# EAGLE design nixie_2020_mainboard_v3_6digit (EAGLE 9.6.2)
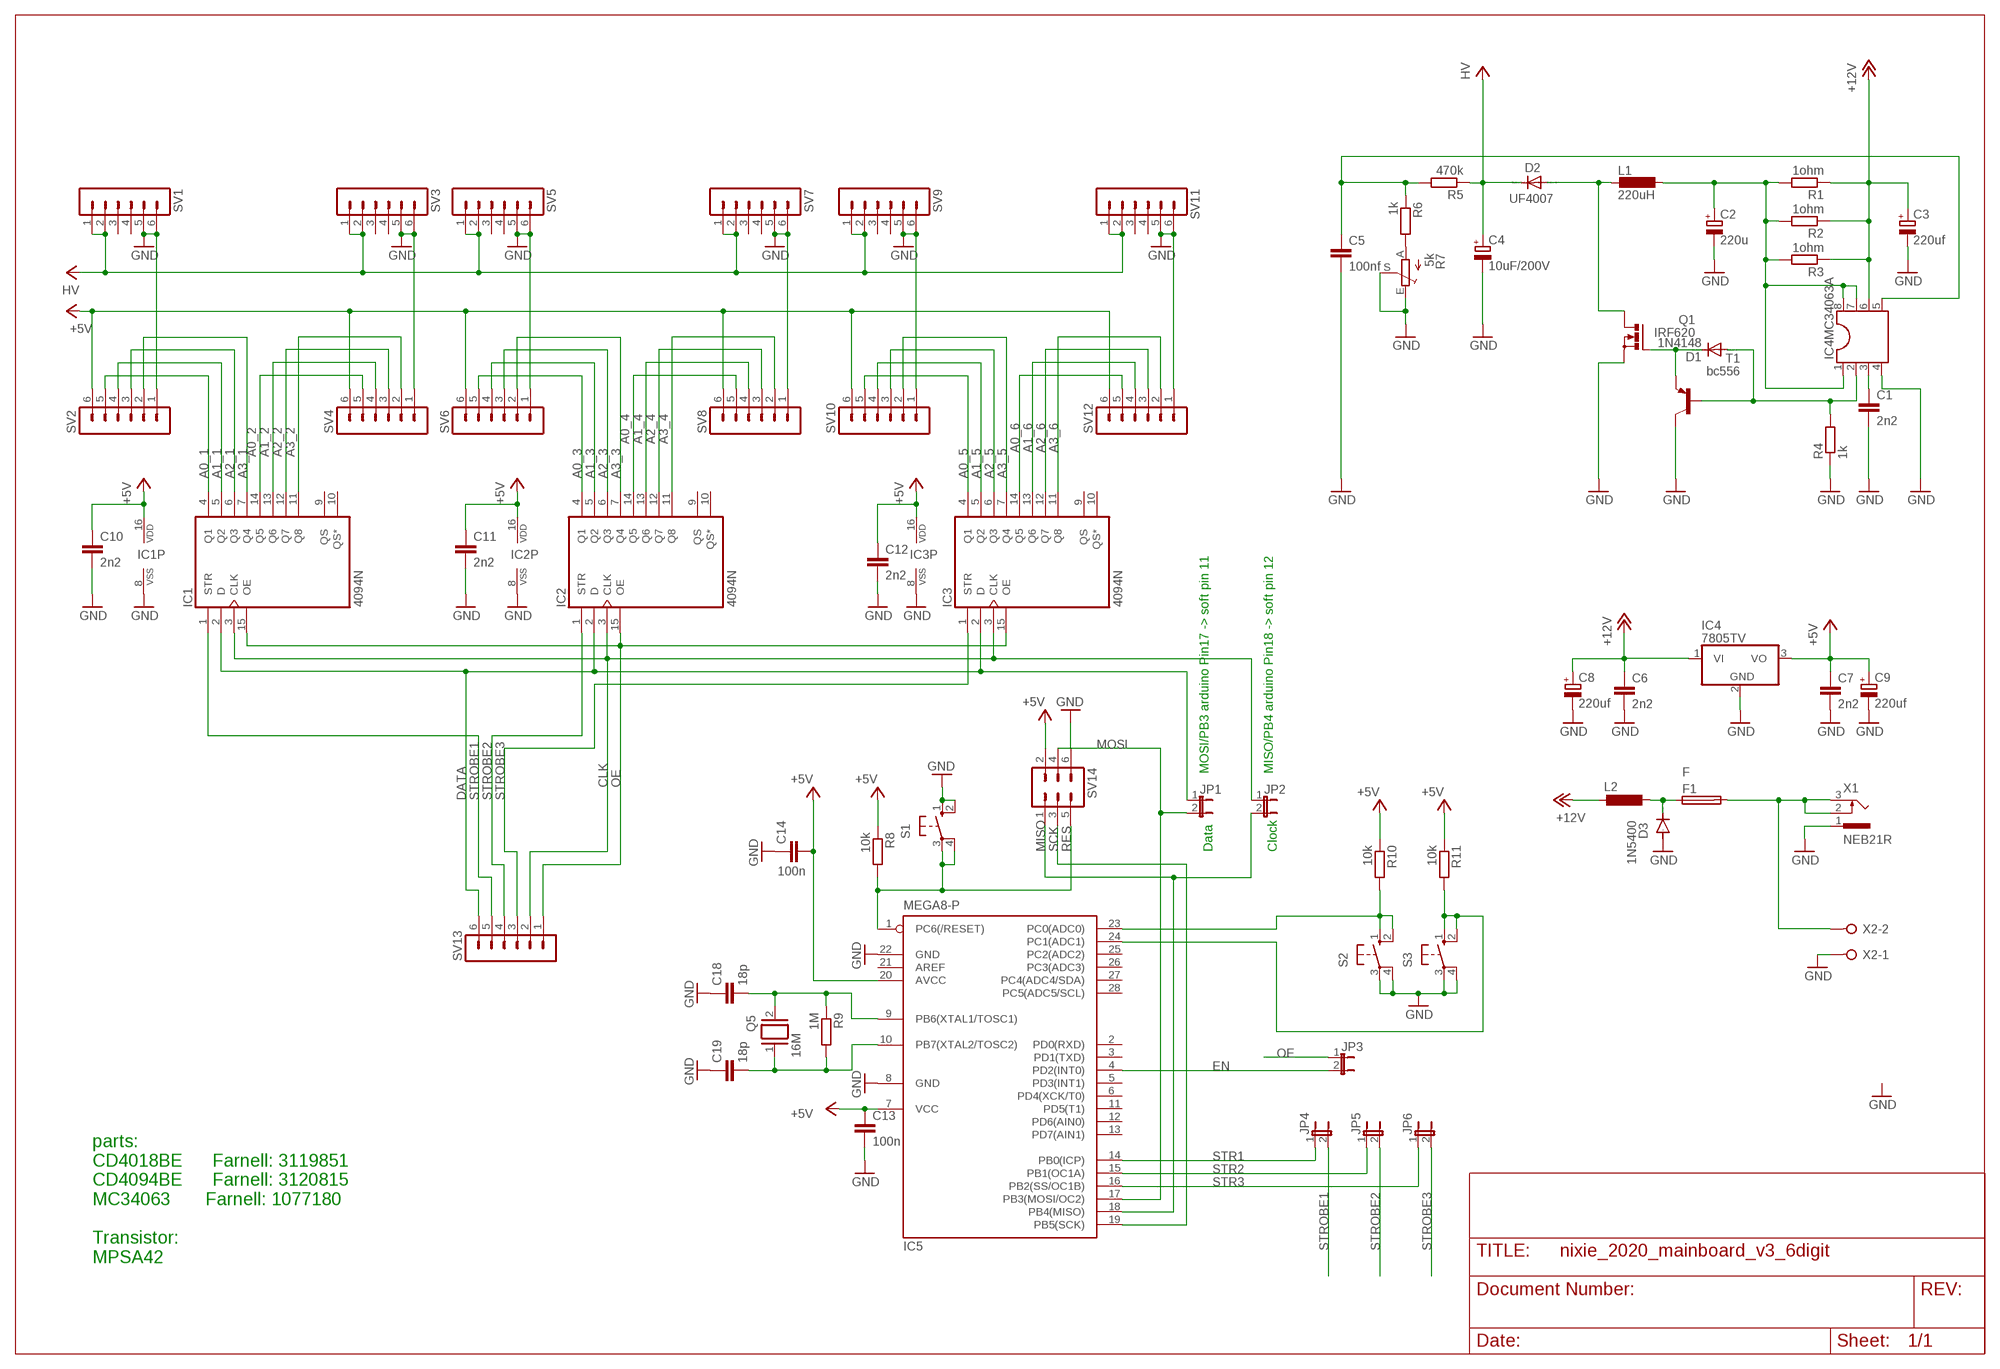
[diagram p0: schematic, sheet 1]

## Parts
C1  2n2  C-EU050-030X075  [C050-030X075]
C2  220u  CPOL-EUE5-10.5  [E5-10,5]
C3  220uf  CPOL-EUE5-10.5  [E5-10,5]
C4  10uF/200V  CPOL-EUE5-10.5  [E5-10,5]
C5  100nf  C-EU075-042X103  [C075-042X103]
C6  2n2  C-EU050-030X075  [C050-030X075]
C7  2n2  C-EU050-030X075  [C050-030X075]
C8  220uf  CPOL-EUE5-10.5  [E5-10,5]
C9  220uf  CPOL-EUE5-10.5  [E5-10,5]
C10  2n2  C-EU050-030X075  [C050-030X075]
C11  2n2  C-EU050-030X075  [C050-030X075]
C12  2n2  C-EU050-030X075  [C050-030X075]
C13  100n  C-EU050-025X075  [C050-025X075]
C14  100n  C-EU050-025X075  [C050-025X075]
C18  18p  C-EU050-025X075  [C050-025X075]
C19  18p  C-EU050-025X075  [C050-025X075]
D1  1N4148  1N4148DO35-10  [DO35-10]
D2  UF4007  BAV21  [DO35-10]
D3  1N5400  [DO201-15]
F1  F  FUSESHK20L  [SHK20L]
IC1  4094N  [DIL16]
IC2  4094N  [DIL16]
IC3  4094N  [DIL16]
IC4  7805TV  [TO220V]
IC4MC34063A  DIL8S  [SOCKET-08]
IC5  MEGA8-P  [DIL28-3]
JP1  JP1E  [JP1]
JP2  JP1E  [JP1]
JP3  JP1E  [JP1]
JP4  JP1E  [JP1]
JP5  JP1E  [JP1]
JP6  JP1E  [JP1]
L1  220uH  L-EULAN02KR  [LAN02KR]
L2  L-EU0207/10  [0207/10]
Q1  IRF620  IRF512  [TO220BV]
Q5  16M  XTAL/S  [QS]
R1  1ohm  R-EU_0207/12  [0207/12]
R2  1ohm  R-EU_0207/12  [0207/12]
R3  1ohm  R-EU_0207/12  [0207/12]
R4  1k  R-EU_0207/12  [0207/12]
R5  470k  R-EU_0207/12  [0207/12]
R6  1k  R-EU_0207/12  [0207/12]
R7  5k  TRIM_EU-RJ9W  [RJ9W]
R8  10k  R-EU_0207/12  [0207/12]
R9  1M  R-EU_0207/12  [0207/12]
R10  10k  R-EU_0207/12  [0207/12]
R11  10k  R-EU_0207/12  [0207/12]
S1  10-XX  [B3F-10XX]
S2  10-XX  [B3F-10XX]
S3  10-XX  [B3F-10XX]
SV1  MA06-1  [MA06-1]
SV2  MA06-1  [MA06-1]
SV3  MA06-1  [MA06-1]
SV4  MA06-1  [MA06-1]
SV5  MA06-1  [MA06-1]
SV6  MA06-1  [MA06-1]
SV7  MA06-1  [MA06-1]
SV8  MA06-1  [MA06-1]
SV9  MA06-1  [MA06-1]
SV10  MA06-1  [MA06-1]
SV11  MA06-1  [MA06-1]
SV12  MA06-1  [MA06-1]
SV13  MA06-1  [MA06-1]
SV14  MA03-2  [MA03-2]
T1  bc556  BC556A-PNP-TO92-EBC  [TO92-EBC]
X1  NEB21R  [NEB21R]
X2  W237-02P  [W237-132]

## Nets
+5V: C7.1 C9.+ C10.1 C11.1 C12.1 C13.1 C14.2 IC1.16(VDD) IC2.16(VDD) IC3.16(VDD) IC4.3(VO) IC5.7(VCC) IC5.20(AVCC) R8.1 R10.1 R11.1 SV2.6 SV4.6 SV6.6 SV8.6 SV10.6 SV12.6 SV14.2
+12V: C3.+ C6.1 C8.+ IC4.1(VI) IC4MC34063A.6 L2.1 R1.1 R2.1 R3.1
A0_1: IC1.4(Q1) SV2.5
A0_2: IC1.14(Q5) SV4.5
A0_3: IC2.4(Q1) SV6.5
A0_4: IC2.14(Q5) SV8.5
A0_5: IC3.4(Q1) SV10.5
A0_6: IC3.14(Q5) SV12.5
A1_1: IC1.5(Q2) SV2.4
A1_2: IC1.13(Q6) SV4.4
A1_3: IC2.5(Q2) SV6.4
A1_4: IC2.13(Q6) SV8.4
A1_5: IC3.5(Q2) SV10.4
A1_6: IC3.13(Q6) SV12.4
A2_1: IC1.6(Q3) SV2.3
A2_2: IC1.12(Q7) SV4.3
A2_3: IC2.6(Q3) SV6.3
A2_4: IC2.12(Q7) SV8.3
A2_5: IC3.6(Q3) SV10.3
A2_6: IC3.12(Q7) SV12.3
A3_1: IC1.7(Q4) SV2.2
A3_2: IC1.11(Q8) SV4.2
A3_3: IC2.7(Q4) SV6.2
A3_4: IC2.11(Q8) SV8.2
A3_5: IC3.7(Q4) SV10.2
A3_6: IC3.11(Q8) SV12.2
CLK: IC1.3(CLK) IC2.3(CLK) IC3.3(CLK) JP2.1 SV13.2
DATA: IC1.2(D) IC2.2(D) IC3.2(D) JP1.1 SV13.6
EN: IC5.4(PD2(INT0)) JP3.2
GND: C1.2 C2.- C3.- C4.- C5.2 C6.2 C7.2 C8.- C9.- C10.2 C11.2 C12.2 C13.2 C14.1 C18.1 C19.1 D3.A IC1.8(VSS) IC2.8(VSS) IC3.8(VSS) IC4.2(GND) IC4MC34063A.4 IC5.8(GND) IC5.22(GND) Q1.S R4.1 R7.E R7.S S1.1(S) S1.2(S1) S2.3(P) S2.4(P1) S3.3(P) S3.4(P1) SV1.5 SV1.6 SV2.1 SV3.5 SV3.6 SV4.1 SV5.5 SV5.6 SV6.1 SV7.5 SV7.6 SV8.1 SV9.5 SV9.6 SV10.1 SV11.5 SV11.6 SV12.1 SV14.6 T1.C X1.1 X2.1
MISO: IC5.18(PB4(MISO)) JP2.2 SV14.1
MOSI: IC5.17(PB3(MOSI/OC2)) JP1.2 SV14.4
N$1: F1.2A X1.2 X1.3 X2.2
N$2: D3.C F1.1A L2.2
N$4: IC5.23(PC0(ADC0)) R10.2 S2.1(S) S2.2(S1)
N$6: IC5.24(PC1(ADC1)) R11.2 S3.1(S) S3.2(S1)
N$35: C18.2 IC5.9(PB6(XTAL1/TOSC1)) Q5.2 R9.1
N$36: C19.2 IC5.10(PB7(XTAL2/TOSC2)) Q5.1 R9.2
N$88: C1.1 IC4MC34063A.3
N$89: D1.A IC4MC34063A.2 R4.2 T1.B
N$90: D1.C Q1.G T1.E
N$91: D2.A L1.2 Q1.D
N$92: C2.+ IC4MC34063A.1 IC4MC34063A.7 IC4MC34063A.8 L1.1 R1.2 R2.2 R3.2
N$93: C5.1 IC4MC34063A.5 R5.2 R6.1
N$94: R6.2 R7.A
OE: IC1.15(OE) IC2.15(OE) IC3.15(OE) JP3.1 SV13.1
RES: IC5.1(PC6(/RESET)) R8.2 S1.3(P) S1.4(P1) SV14.5
SCK: IC5.19(PB5(SCK)) SV14.3
STR1: IC5.14(PB0(ICP)) JP4.1
STR2: IC5.15(PB1(OC1A)) JP5.1
STR3: IC5.16(PB2(SS/OC1B)) JP6.1
STROBE1: IC1.1(STR) JP4.2 SV13.5
STROBE2: IC2.1(STR) JP5.2 SV13.4
STROBE3: IC3.1(STR) JP6.2 SV13.3
VCC: C4.+ D2.C R5.1 SV1.1 SV1.2 SV3.1 SV3.2 SV5.1 SV5.2 SV7.1 SV7.2 SV9.1 SV9.2 SV11.1 SV11.2 ; supply symbol labelled HV
Unconnected: IC1.9(QS) IC1.10(QS*) IC2.9(QS) IC2.10(QS*) IC3.9(QS) IC3.10(QS*) IC5.2(PD0(RXD)) IC5.3(PD1(TXD)) IC5.5(PD3(INT1)) IC5.6(PD4(XCK/T0)) IC5.11(PD5(T1)) IC5.12(PD6(AIN0)) IC5.13(PD7(AIN1)) IC5.21(AREF) IC5.25(PC2(ADC2)) IC5.26(PC3(ADC3)) IC5.27(PC4(ADC4/SDA)) IC5.28(PC5(ADC5/SCL)) SV1.3 SV1.4 SV3.3 SV3.4 SV5.3 SV5.4 SV7.3 SV7.4 SV9.3 SV9.4 SV11.3 SV11.4

## Notes on the sheet
- MOSI/PB3 arduino Pin17 -> soft pin 11 | MISO/PB4 arduino Pin18 -> soft pin 12
- Data | Clock
- parts:
  CD4018BE      Farnell: 3119851
  CD4094BE      Farnell: 3120815
  MC34063       Farnell: 1077180
  
  Transistor:
  MPSA42

## Library data of the parts
C1 C5-C7 C10-C12 = rcl:C-EU: CAPACITOR, European symbol
C2-C4 C8 C9 = rcl:CPOL-EU: POLARIZED CAPACITOR, European symbol
C13 C14 C18 C19 = resistor:C-EU: CAPACITOR, European symbol
D1 = diode:1N4148: DIODE high speed (Philips)
D2 = diode:BAV21: DIODE high-voltage general purpose diode
D3 = diode:1N5400: DIODE standard rectifier, 3 A, 50 V (Motorola)
F1 = fuse:FUSE: Fuse; OC_FARNELL: unknown; OC_NEWARK: unknown
IC1-IC3 = 40xx:4094: 8-stage SHIFT/STORE REGISTER, tri-state
IC4 = linear:78*: Positive VOLTAGE REGULATOR Source: http://cache.national.com/ds/LM/LM78L05.pdf http://www.fairchildsemi.com/ds/LM/LM7805.pdf
IC4MC34063A = ic-package:DIL8: Dual In Line / Socket
IC5 = atmel:MEGA8-P: MICROCONTROLLER 8 Kbytes FLASH, 1 kbytes SRAM, 512 bytes EEPROM, USART, 4-channel 10 bit ADC, 2-channel 8 bit ADC Pin compatible with Atmega48, ATMega88, ATMega168 Source: avr.lbr; OC_FARNELL: unknown; OC_NEWARK: unknown
JP1-JP6 = jumper:JP1E: JUMPER
L1 = rcl:L-EU: INDUCTOR, European symbol
L2 = rcl:L-EU: INDUCTOR, European symbol; SPICEPREFIX: L
Q1 = transistor-power:IRF512: N-CHANNEL MOS FET
Q5 = special:XTAL/S: CRYSTAL
R1-R6 R8-R11 = rcl:R-EU_: RESISTOR, European symbol
R7 = pot:TRIM_EU-: POTENTIOMETER
S1-S3 = switch-omron:10-XX: OMRON SWITCH; MPN: B3F-1000; OC_FARNELL: 176432; OC_NEWARK: 36M3542
SV1-SV13 = con-lstb:MA06-1: PIN HEADER; OC_FARNELL: unknown; OC_NEWARK: unknown
SV14 = con-lstb:MA03-2: PIN HEADER; OC_FARNELL: unknown; OC_NEWARK: unknown
T1 = transistor:*-PNP-: PNP Transistror
X1 = con-lumberg:NEB21R: Netzgeräte-Einbaukupplung abgewinkelte Ausführung mit Öffner Source: http://www.lumberg.com/Produkte/PDFs/NEB21R.pdf; MPN: NEB 21 R; OC_FARNELL: 1217037; OC_NEWARK: 97K6458
X2 = con-wago-508:W237-02P: WAGO SREW CLAMP; OC_FARNELL: unknown; OC_NEWARK: unknown

## Board
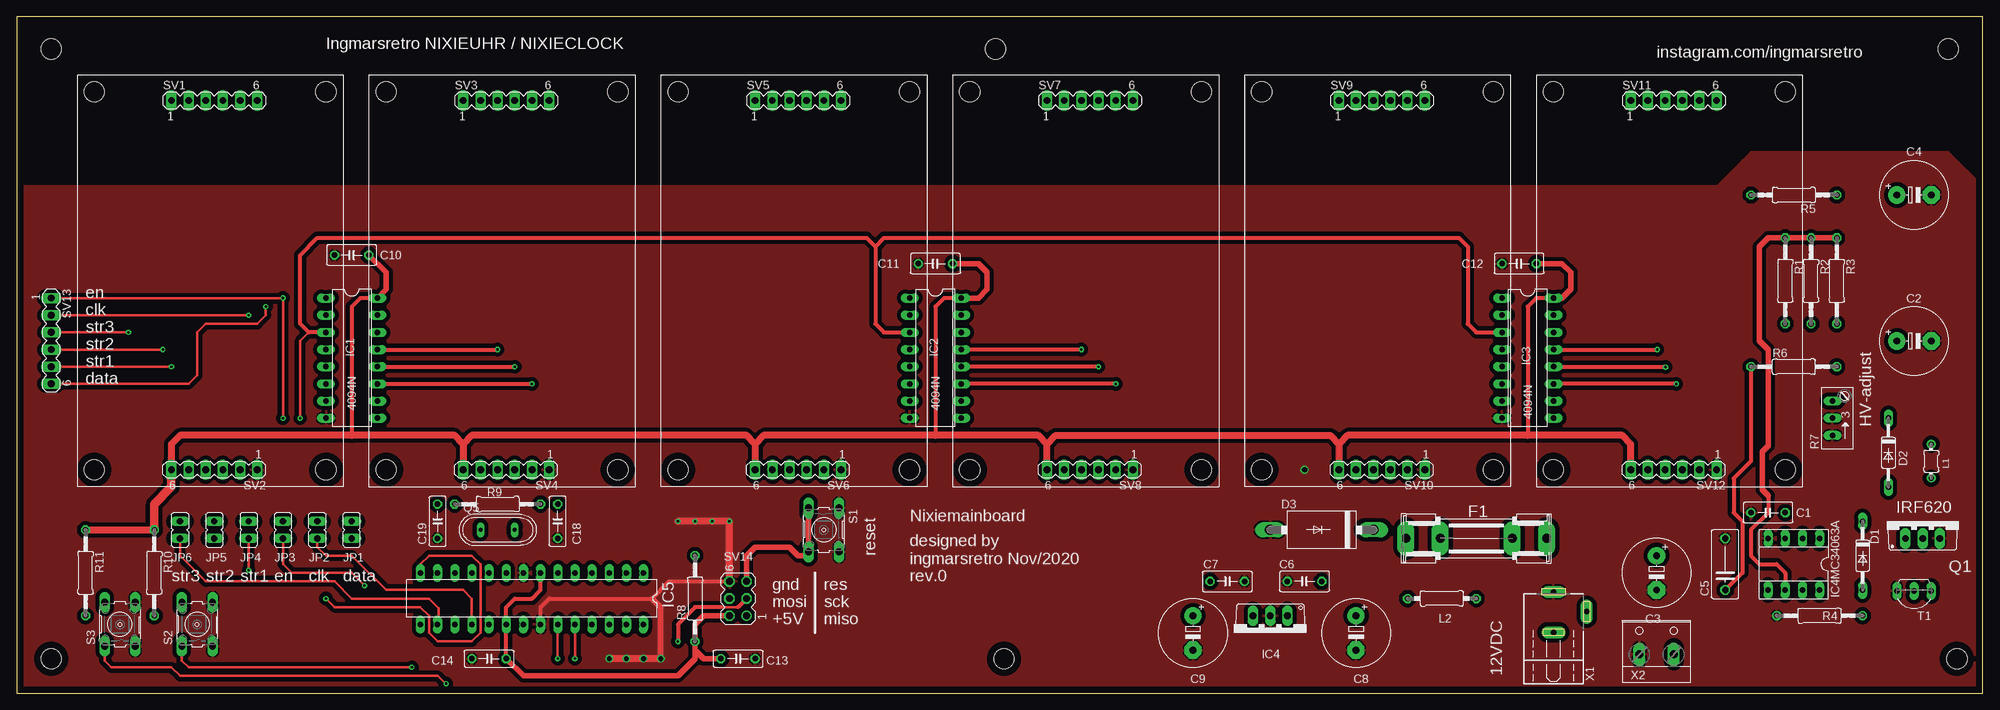
[diagram p1: board, top side]
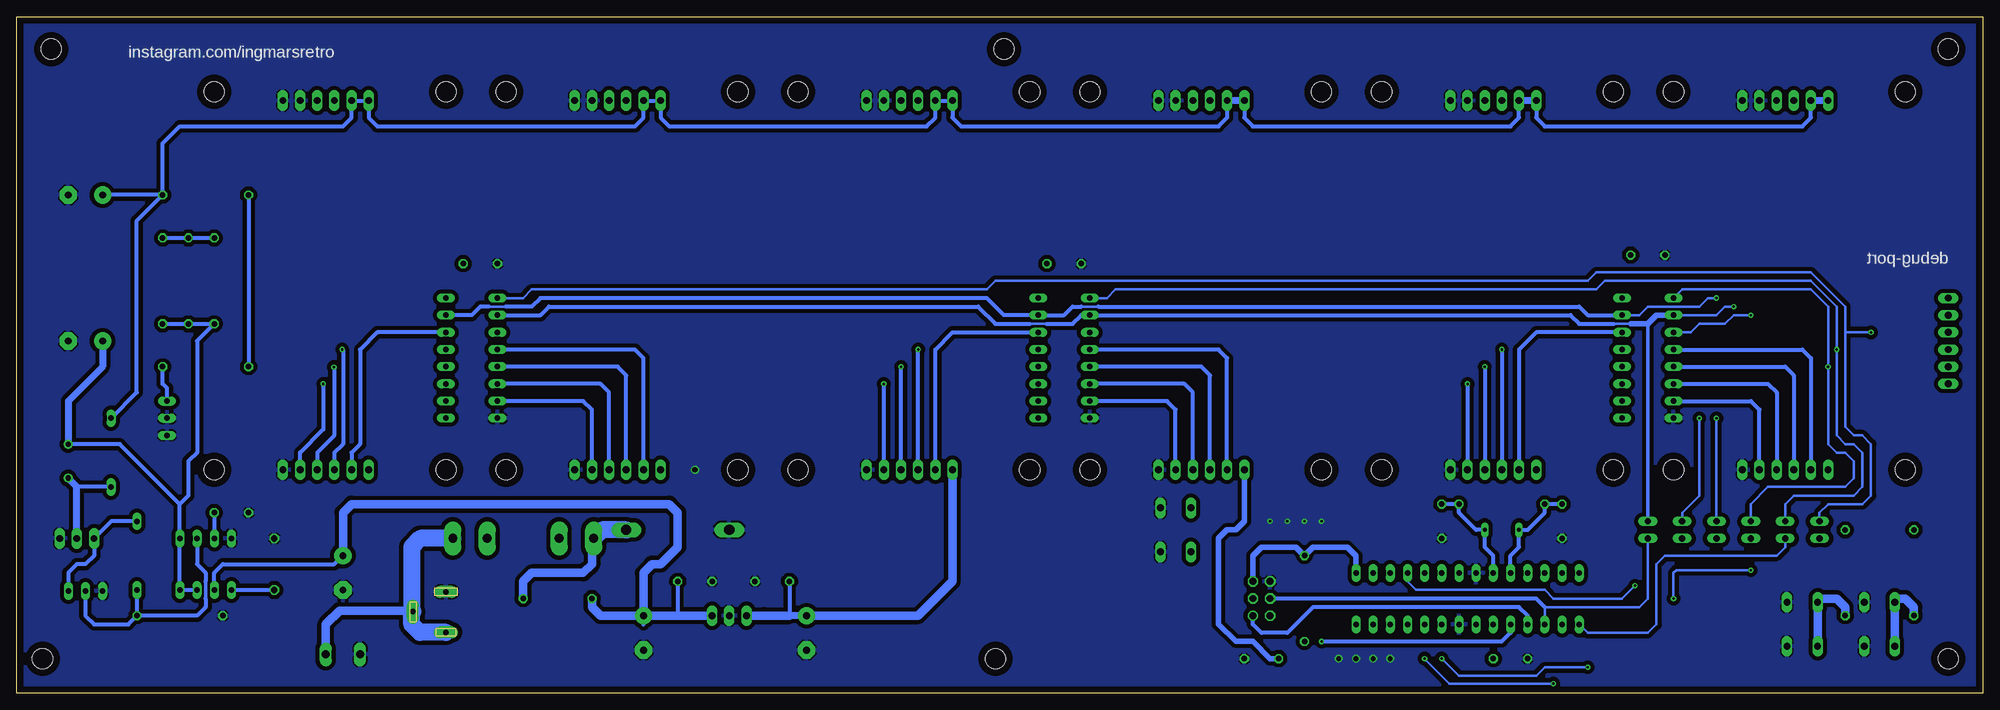
[diagram p2: board, bottom side, seen from below]

Size 290.81 x 100 mm. Coordinates in mm from the lower left corner, seen from the top.
Outline: 0,0 290.81,0 290.81,100 0,100 0,0
Copper layers (1*16): Top 0.035mm / dielectric 1.5mm / Bottom 0.035mm
Design rules "default": minimum track width 6mil, minimum drill 0.35mm, track to track 6mil, track to pad 6mil, pad to pad 6mil, via to via 6mil, smd to smd 6mil, copper to edge 40mil, drill to drill 6mil, minimum pad ring 10mil, minimum via ring 8mil, stop-mask expansion 4mil, vias tented up to drill 0mil, thermal gap 10mil
Holes 3 mm at 97.79,88.9 132.08,88.9 132.08,33.02 97.79,33.02 184.15,88.9 218.44,88.9 218.44,33.02 184.15,33.02 227.33,88.9 261.62,88.9 261.62,33.02 227.33,33.02 140.97,88.9 175.26,88.9 175.26,33.02 140.97,33.02 5.08,95.25 5.08,5.08 287.02,5.08 285.75,95.25 54.61,88.9 11.43,88.9 88.9,88.9 45.72,88.9 54.61,33.02 11.43,33.02 88.9,33.02 45.72,33.02 144.78,95.25 146.05,5.08

### Footprints (pad centres in the part's own frame; a part is rotated, then mirrored left to right if it is on the bottom)
C050-030X075 = drill 0.813 octagon: 1 -2.54,0; 2 2.54,0
E5-10,5 = drill 1.016 pad 2.54: + -2.54,0 | drill 1.016 pad 2.54 octagon: - 2.54,0
C075-042X103 = drill 0.914 octagon: 1 -3.81,0; 2 3.81,0
C050-025X075 = drill 0.813 octagon: 1 -2.54,0; 2 2.54,0
DO35-10 = drill 0.813 long: A 5.08,0; C -5.08,0
DO201-15 = drill 1.499 long: A 7.62,0; C -7.62,0
SHK20L = drill 1.321 pad 2.54 long: 1A -10.414,0; 1B -5.334,0; 2A 10.414,0; 2B 5.334,0
DIL16 = drill 0.813 long: 1 -8.89,-3.81; 2 -6.35,-3.81; 3 -3.81,-3.81; 4 -1.27,-3.81; 5 1.27,-3.81; 6 3.81,-3.81; 7 6.35,-3.81; 8 8.89,-3.81; 9 8.89,3.81; 10 6.35,3.81; 11 3.81,3.81; 12 1.27,3.81; 13 -1.27,3.81; 14 -3.81,3.81; 15 -6.35,3.81; 16 -8.89,3.81
TO220V = drill 1.016 long: 1 -2.54,-2.54; 2 0,-2.54; 3 2.54,-2.54
SOCKET-08 = drill 0.813 long: 1 -3.81,-3.81; 2 -1.27,-3.81; 3 1.27,-3.81; 4 3.81,-3.81; 5 3.81,3.81; 6 1.27,3.81; 7 -1.27,3.81; 8 -3.81,3.81
DIL28-3 = drill 0.813 long: 1 -16.51,-3.81; 2 -13.97,-3.81; 3 -11.43,-3.81; 4 -8.89,-3.81; 5 -6.35,-3.81; 6 -3.81,-3.81; 7 -1.27,-3.81; 8 1.27,-3.81; 9 3.81,-3.81; 10 6.35,-3.81; 11 8.89,-3.81; 12 11.43,-3.81; 13 13.97,-3.81; 14 16.51,-3.81; 15 16.51,3.81; 16 13.97,3.81; 17 11.43,3.81; 18 8.89,3.81; 19 6.35,3.81; 20 3.81,3.81; 21 1.27,3.81; 22 -1.27,3.81; 23 -3.81,3.81; 24 -6.35,3.81; 25 -8.89,3.81; 26 -11.43,3.81; 27 -13.97,3.81; 28 -16.51,3.81
JP1 = drill 0.914 long: 1 0,-1.27; 2 0,1.27
LAN02KR = drill 0.8 pad 1.3: 1 -2.5,0; 2 2.5,0
0207/10 = drill 0.813 octagon: 1 -5.08,0; 2 5.08,0
TO220BV = drill 1.016 long: D 0,-2.54; G -2.54,-2.54; S 2.54,-2.54
QS = drill 0.61 long: 1 -2.54,0; 2 2.54,0
0207/12 = drill 0.813 octagon: 1 -6.35,0; 2 6.35,0
RJ9W = drill 0.813 long: A 2.54,0.635; E -2.54,0.635; S 0,0.635
B3F-10XX = drill 1.016 long: 1 -3.251,2.261; 2 3.251,2.261; 3 -3.251,-2.261; 4 3.251,-2.261
MA06-1 = drill 1.016 long: 1 -6.35,0; 2 -3.81,0; 3 -1.27,0; 4 1.27,0; 5 3.81,0; 6 6.35,0
MA03-2 = drill 1.016: 1 -2.54,-1.27 | drill 1.016 octagon: 2 -2.54,1.27; 3 0,-1.27; 4 0,1.27; 5 2.54,-1.27; 6 2.54,1.27
TO92-EBC = drill 0.813 long: B 0,-1.27; C 2.54,-1.27; E -2.54,-1.27
NEB21R = drill 0.813 pad 1.778 long: 1 0,7.35; 2 4.9,4.4; 3 0,1.35
W237-132 = drill 1.194 long: 1 -2.54,-0.635; 2 2.54,-0.635

### Placement (x,y rotation side)
C1  259.08,26.67 180 top
C2  280.67,52.07 0 top
C3  242.57,17.78 270 top
C4  280.67,73.66 0 top
C5  252.73,19.05 90 top
C6  190.5,16.51 180 top
C7  179.07,16.51 0 top
C8  198.12,8.89 270 top
C9  173.99,8.89 270 top
C10  49.53,64.77 180 top
C11  135.89,63.5 180 top
C12  222.25,63.5 180 top
C13  106.68,5.08 0 top
C14  69.85,5.08 0 top
C18  80.01,25.4 90 top
C19  62.23,25.4 90 top
D1  273.05,20.32 270 top
D2  276.86,35.56 270 top
D3  193.04,24.13 180 top
F1  215.9,22.86 0 top
IC1  49.53,49.53 270 top
IC2  135.89,49.53 270 top
IC3  223.52,49.53 270 top
IC4  185.42,8.89 180 top
IC4MC34063A  262.89,19.05 180 top
IC5  76.2,13.97 180 top
JP1  49.53,24.13 180 top
JP2  44.45,24.13 180 top
JP3  39.37,24.13 180 top
JP4  34.29,24.13 0 top
JP5  29.21,24.13 0 top
JP6  24.13,24.13 0 top
L1  283.21,34.29 270 top
L2  210.82,13.97 0 top
Q1  281.94,25.4 0 top
Q5  71.12,24.13 0 top
R1  261.62,60.96 270 top
R2  265.43,60.96 270 top
R3  269.24,60.96 270 top
R4  266.7,11.43 0 top
R5  262.89,73.66 180 top
R6  262.89,48.26 0 top
R7  269.24,40.64 90 top
R8  100.33,13.97 90 top
R9  71.12,27.94 180 top
R10  20.32,17.78 270 top
R11  10.16,17.78 270 top
S1  119.38,24.13 270 top
S2  26.67,10.16 90 top
S3  15.24,10.16 90 top
SV1  29.21,87.63 0 top
SV2  29.21,33.02 180 top
SV3  72.39,87.63 0 top
SV4  72.39,33.02 180 top
SV5  115.57,87.63 0 top
SV6  115.57,33.02 180 top
SV7  158.75,87.63 0 top
SV8  158.75,33.02 180 top
SV9  201.93,87.63 0 top
SV10  201.93,33.02 180 top
SV11  245.11,87.63 0 top
SV12  245.11,33.02 180 top
SV13  5.08,52.07 270 top
SV14  106.68,13.97 90 top
T1  280.67,13.84 180 top
X1  227.33,7.62 0 top
X2  242.57,6.35 0 top

### Tracks (layer width: path | path; a pad name or v marks a point on that pad's centre or on a via)
+5V
  Top 0.61: IC1.16 50.8,58.42 49.53,57.15 49.53,38.1 | IC2.16 137.16,58.42 135.89,57.15 135.89,38.1 | IC3.16 224.79,58.42 223.52,57.15 223.52,38.1 | C14.2 IC5.20 72.39,12.7 73.66,13.97 76.2,13.97 77.47,15.24 IC5.7
  Top 0.813: C10.1 54.61,62.23 54.61,59.69 IC1.16 | C11.1 142.24,63.5 143.51,62.23 143.51,59.69 142.24,58.42 IC2.16 | C12.1 228.6,63.5 229.87,62.23 229.87,59.69 228.6,58.42 IC3.16 | R8.1 100.33,10.16 101.6,11.43 SV14.2 | R8.1 100.33,6.35 101.6,5.08 C13.1 | R8.1 100.33,5.08 97.79,2.54 77.47,2.54 74.93,2.54 C14.2
  Top 1.016: SV12.6 238.76,36.83 237.49,38.1 223.52,38.1 196.85,38.1 195.58,36.83 | 195.58,36.83 SV10.6 | 152.4,36.83 153.67,38.1 194.31,38.1 195.58,36.83 | SV8.6 152.4,36.83 | 152.4,36.83 151.13,38.1 135.89,38.1 110.49,38.1 109.22,36.83 | 109.22,36.83 SV6.6 | 109.22,36.83 107.95,38.1 67.31,38.1 66.04,36.83 | 66.04,36.83 SV4.6 | 66.04,36.83 64.77,38.1 49.53,38.1 24.13,38.1 22.86,36.83 SV2.6 | R11.1 R10.1
  Top 1.27: SV2.6 22.86,30.48 20.32,27.94 R10.1
  Bottom 0.61: C7.1 176.53,11.43
  Bottom 0.813: SV6.6 109.22,25.4 110.49,24.13 111.76,24.13 113.03,22.86 113.03,10.16 110.49,7.62 107.95,7.62 105.41,5.08 C13.1
  Bottom 1.016: C9.+ 180.34,11.43
  Bottom 1.27: IC4.3 180.34,11.43 176.53,11.43 | SV8.6 152.4,16.51 157.48,11.43 C9.+
+12V
  Top 0.61: 259.08,29.21 259.08,26.67 256.54,24.13 256.54,20.32 257.81,19.05 260.35,19.05 261.62,17.78 IC4MC34063A.6
  Top 0.813: R3.1 R1.1 259.08,67.31 257.81,66.04 257.81,52.07 259.08,50.8 259.08,36.58 258.19,35.69 258.19,30.1 259.08,29.21
  Bottom 0.61: R3.1 R2.1 R1.1 | IC4MC34063A.6 261.62,17.78 260.35,19.05 243.84,19.05 C3.+ | C6.1 193.04,11.43 | 198.12,10.16 C8.+
  Bottom 1.27: IC4.1 193.04,11.43 C8.+ | C3.+ 242.57,26.67 241.3,27.94 194.31,27.94 193.04,26.67 193.04,21.59 195.58,19.05 196.85,19.05 198.12,17.78 C8.+ | L2.1 205.74,12.7 204.47,11.43 C8.+
A0_1
  Bottom 0.61: IC1.4 26.67,50.8 25.4,49.53 SV2.5
A0_2
  Bottom 0.61: SV4.5 68.58,50.8 66.04,53.34 IC1.14
A0_3
  Bottom 0.61: SV6.5 111.76,49.53 113.03,50.8 IC2.4
A0_4
  Bottom 0.61: IC2.14 152.4,53.34 154.94,50.8 SV8.5
A0_5
  Bottom 0.61: IC3.4 199.39,50.8 198.12,49.53 SV10.5
A0_6
  Bottom 0.61: IC3.14 237.49,53.34 240.03,50.8 240.03,36.83 241.3,35.56 SV12.5
A1_1
  Bottom 0.61: IC1.5 29.21,48.26 27.94,46.99 SV2.4
A1_2  (via drill 0.35)
  Top 0.61: IC1.13 v71.12,50.8
  Bottom 0.61: v71.12,50.8 SV4.4
A1_3
  Bottom 0.61: 114.3,34.29 SV6.4 114.3,46.99 115.57,48.26 IC2.5
A1_4  (via drill 0.35)
  Top 0.61: v157.48,50.8 IC2.13
  Bottom 0.61: SV8.4 v157.48,50.8
A1_5
  Bottom 0.61: SV10.4 200.66,46.99 201.93,48.26 IC3.5
A1_6  (via drill 0.35)
  Top 0.61: IC3.13 v242.7,50.8
  Bottom 0.61: v242.7,50.8 242.57,50.67 242.57,36.83 243.84,35.56 SV12.4
A2_1
  Bottom 0.61: SV2.3 30.48,44.45 31.75,45.72 IC1.6
A2_2  (via drill 0.35)
  Top 0.61: IC1.12 v73.66,48.26
  Bottom 0.61: v73.66,48.26 SV4.3
A2_3
  Bottom 0.61: IC2.6 118.11,45.72 116.84,44.45 SV6.3
A2_4  (via drill 0.35)
  Top 0.61: v160.02,48.26 IC2.12
  Bottom 0.61: SV8.3 v160.02,48.26
A2_5
  Bottom 0.61: SV10.3 203.2,44.45 204.47,45.72 IC3.6
A2_6  (via drill 0.35)
  Top 0.61: v243.9,48.2 243.84,48.26 IC3.12
  Bottom 0.61: v243.9,48.2 243.9,38.04 246.38,35.56 SV12.3
A3_1
  Bottom 0.61: IC1.7 34.29,43.18 33.02,41.91 SV2.2
A3_2  (via drill 0.35)
  Top 0.61: IC1.11 v76.2,45.72
  Bottom 0.61: v76.2,45.72 SV4.2
A3_3
  Bottom 0.61: SV6.2 119.38,41.91 120.65,43.18 IC2.7
A3_4  (via drill 0.35)
  Top 0.61: v162.56,45.72 IC2.11
  Bottom 0.61: SV8.2 v162.56,45.72
A3_5
  Bottom 0.61: SV10.2 205.74,41.91 207.01,43.18 IC3.7
A3_6  (via drill 0.35)
  Top 0.61: v245.49,45.72 IC3.11
  Bottom 0.61: v245.49,45.72 245.49,38.99 248.92,35.56 SV12.2
CLK  (via drill 0.35)
  Top 0.406: v41.91,40.64 41.91,52.07 43.18,53.34 | SV13.2 v34.29,55.88
  Top 0.61: IC1.3 43.18,53.34 41.91,54.61 41.91,64.77 44.45,67.31 125.73,67.31 127,66.04 | 127,66.04 127,54.61 128.27,53.34 IC2.3 | 127,66.04 128.27,67.31 213.36,67.31 214.63,66.04 214.63,54.61 215.9,53.34 IC3.3
  Bottom 0.406: JP2.1 44.45,26.67 41.91,29.21 v41.91,40.64 | v34.29,55.88 36.83,55.88 38.1,54.61 41.91,54.61 43.18,53.34 IC1.3
DATA  (via drill 0.35)
  Top 0.406: SV13.6 25.4,45.72 26.67,46.99 26.67,53.34 27.94,54.61 35.56,54.61 36.83,55.88 v36.83,57.15
  Bottom 0.406: 140.97,54.61 138.43,54.61 | 54.61,54.61 52.07,54.61 | JP1.1 49.53,27.94 | v36.83,57.15 38.1,57.15 39.37,55.88 IC1.2
  Bottom 0.508: JP1.1 49.53,54.61
  Bottom 0.61: IC3.2 213.36,55.88 212.09,57.15 148.59,57.15 146.05,54.61 140.97,54.61 | 138.43,54.61 134.62,54.61 133.35,55.88 IC2.2 60.96,55.88 59.69,54.61 54.61,54.61
  Bottom 0.813: 52.07,54.61 49.53,54.61 48.26,55.88 IC1.2
EN  (via drill 0.35)
  Top 0.406: JP3.2 39.37,19.05 40.64,17.78 49.53,17.78 v51.44,15.88
  Bottom 0.406: IC5.4 85.09,16.51 83.82,15.24 64.77,15.24 63.5,13.97 53.34,13.97 v51.44,15.88
GND  (via drill 0.35, 0.7, 0.8)
  Top 0.61: IC5.22 77.47,12.7 78.74,13.97 93.98,13.97 96.52,16.51 SV14.6
  Top 0.813: 93.98,13.97 95.25,12.7 v95.25,5.08
  Top 1.016: SV14.6 v105.41,25.4 v102.87,25.4 v100.33,25.4 v97.79,25.4 | v95.25,5.08 v92.71,5.08 v90.17,5.08 v87.63,5.08
  other vias: 190.5,33.02
  pour Bottom (isolate 0.61): 0,100.33 290.83,100.33 290.83,0 0,0
  pour Top (isolate 0.61): 0,0 0,74.93 251.46,74.93 255.27,78.74 256.54,80.01 285.75,80.01 290.83,74.93 290.83,0
MISO
  Top 0.406: IC5.18 67.31,13.97 66.04,15.24 54.61,15.24 49.53,20.32 45.72,20.32 44.45,21.59 JP2.2
  Bottom 0.61: IC5.18 67.31,11.43 68.58,12.7 99.06,12.7 102.87,8.89 106.68,8.89 107.95,10.16 SV14.1
MOSI
  Bottom 0.406: IC5.17 64.77,12.7 50.8,12.7 49.53,13.97 JP1.2
  Bottom 0.61: 64.77,12.7 66.04,13.97 SV14.4
N$1
  Bottom 1.27: 232.41,12.2 243.07,12.2 245.11,10.16 X2.2
  Bottom 2.54: F1.2A 231.14,22.86 232.41,21.59 232.41,12.2 | 232.41,12.2 X1.2 | X1.3 231.22,8.97 232.41,10.16 232.41,12.2
N$2
  Bottom 1.27: F1.1A 205.74,22.61 205.74,19.05 207.01,17.78 214.63,17.78 215.9,16.51 L2.2
  Bottom 2.54: D3.C 204.22,24.13 F1.1A
N$4  (via drill 0.35)
  Top 0.406: IC5.23 v80.01,5.08 | S2.1 24.41,4.8 25.4,3.81 v58.42,3.81
  Bottom 0.406: v80.01,5.08 77.47,2.54 66.04,2.54 64.77,3.81 v58.42,3.81
  Bottom 1.27: S2.1 S2.2 23.85,13.97 21.59,13.97 20.32,12.7 R10.2
N$6  (via drill 0.35)
  Top 0.406: IC5.24 v82.55,5.08 | S3.1 12.98,4.8 13.97,3.81 22.86,3.81 24.13,2.54 62.23,2.54 63.5,1.27 v63.5,1.39
  Bottom 0.406: v82.55,5.08 78.86,1.39 v63.5,1.39
  Bottom 1.27: S3.1 S3.2 12.42,13.97 11.43,13.97 10.16,12.7 R11.2
N$35
  Bottom 0.61: IC5.9 72.39,20.32 73.66,21.59 Q5.2 74.93,24.13 77.47,26.67 R9.1 C18.2
N$36
  Bottom 0.61: IC5.10 69.85,20.32 68.58,21.59 Q5.1 67.31,24.13 64.77,26.67 R9.2 C19.2
N$88
  Bottom 0.61: C1.1 IC4MC34063A.3
N$89
  Bottom 0.508: 262.89,16.51 262.89,13.97
  Bottom 0.61: D1.A R4.2 | T1.B 280.67,11.43 279.4,10.16 274.32,10.16 R4.2 | IC4MC34063A.2 264.16,19.05 262.89,17.78 262.89,16.51 | 262.89,13.97 262.89,12.7 264.16,11.43 R4.2
N$90
  Bottom 0.61: D1.C 276.86,25.4 Q1.G 279.4,20.32 280.67,19.05 281.94,19.05 283.21,17.78 T1.E
N$91  (1 unrouted)
  Bottom 0.61: D2.A 281.94,30.48
  Bottom 1.016: 283.21,31.75 281.94,30.48 Q1.D
N$92
  Bottom 0.61: R3.2 R2.2 R1.2 264.16,52.07 264.16,35.56 265.43,34.29 265.43,29.21 266.7,27.94 | 266.7,27.94 IC4MC34063A.1 IC4MC34063A.8 IC4MC34063A.7 | L1.1 283.17,36.83 275.59,36.83 266.7,27.94
  Bottom 1.016: C2.+ 278.13,48.26 283.21,43.18 L1.1
N$93
  Top 0.61: R6.1 256.54,34.29 254,31.75 254,26.67 255.27,25.4 255.27,17.78 C5.1
  Bottom 0.61: R5.2 R6.1 | IC4MC34063A.5 C5.1
N$94
  Bottom 0.61: R7.A 268.61,45.09 269.24,45.72 R6.2
OE  (via drill 0.35)
  Top 0.406: v39.37,40.64 v39.37,58.42 SV13.1
  Bottom 0.406: 218.44,57.15 220.98,57.15 | 133.35,57.15 130.81,57.15 | JP3.1 v39.37,40.64 | IC1.15 50.8,55.88 49.53,57.15 41.91,57.15 40.64,58.42 v39.37,58.42
  Bottom 0.61: 218.44,57.15 214.63,57.15 213.36,58.42 147.32,58.42 144.78,55.88 IC2.15 135.89,55.88 134.62,57.15 133.35,57.15 | 220.98,57.15 222.25,57.15 223.52,55.88 IC3.15 | IC1.15 58.42,55.88 59.69,57.15 130.81,57.15
RES
  Top 0.813: SV14.5 107.95,20.32 109.22,21.59 114.3,21.59 115.57,20.32 116.56,20.32 S1.4 S1.3
  Bottom 0.813: IC5.1 92.71,20.32 93.98,21.59 99.06,21.59 R8.2 101.6,21.59 106.68,21.59 107.95,20.32 SV14.5
SCK  (via drill 0.35)
  Top 0.406: 106.68,12.7 104.14,12.7
  Top 0.61: SV14.3 106.68,12.7 | 104.14,12.7 100.33,12.7 97.79,10.16 v97.79,7.62
  Bottom 0.61: v97.79,7.62 71.12,7.62 69.85,8.89 IC5.19
STR1  (via drill 0.35)
  Top 0.406: JP4.1 v34.29,18.16 | v45.72,13.97 46.99,12.7 59.69,12.7 60.96,11.43 60.96,8.89 62.23,7.62 67.31,7.62 68.58,8.89 68.58,19.05 67.31,20.32 60.96,20.32 59.69,19.05 IC5.14
  Bottom 0.406: v34.29,18.16 45.34,18.16 45.72,17.78 v45.72,13.97
STR2
  Bottom 0.406: IC5.15 58.42,8.89 49.53,8.89 48.26,10.16 48.26,19.05 46.99,20.32 30.48,20.32 29.21,21.59 JP5.1
STR3
  Top 0.406: IC5.16 62.36,10.29 62.36,12.57 60.96,13.97 49.53,13.97 46.99,16.51 27.94,16.51 24.13,20.32 JP6.1
STROBE1  (via drill 0.35)
  Top 0.406: SV13.5 v22.86,48.26
  Bottom 0.406: JP4.2 34.29,27.94 31.75,30.48 20.32,30.48 19.05,31.75 19.05,34.29 20.32,35.56 21.59,35.56 22.86,36.83 v22.86,48.26 22.86,57.15 25.4,59.69 44.45,59.69 IC1.1
STROBE2  (via drill 0.35)
  Top 0.406: SV13.4 v21.59,50.8
  Bottom 0.406: IC2.1 129.54,58.42 128.27,59.69 57.15,59.69 55.88,60.96 25.4,60.96 21.59,57.15 v21.59,50.8 21.59,38.1 20.32,36.83 19.05,36.83 17.78,35.56 17.78,30.48 19.05,29.21 27.94,29.21 29.21,27.94 JP5.2
STROBE3  (via drill 0.35)
  Top 0.406: SV13.3 v16.51,53.34
  Bottom 0.406: IC3.1 215.9,58.42 214.63,59.69 147.32,59.69 146.05,60.96 58.42,60.96 57.15,62.23 25.4,62.23 20.32,57.15 20.32,53.34 | JP6.2 24.13,26.67 22.86,27.94 17.78,27.94 16.51,29.21 16.51,36.83 17.78,38.1 19.05,38.1 20.32,39.37 20.32,53.34 | v16.51,53.34 20.32,53.34
VCC
  Bottom 0.61: R5.1 C4.+ | D2.C 273.05,44.45 273.05,69.85 R5.1 | R5.1 269.24,81.28 266.7,83.82 242.57,83.82 241.3,85.09 SV11.2 SV11.1 238.76,85.09 237.49,83.82 199.39,83.82 198.12,85.09 SV9.2 SV9.1 195.58,85.09 194.31,83.82 156.21,83.82 154.94,85.09 SV7.2 SV7.1 152.4,85.09 151.13,83.82 113.03,83.82 111.76,85.09 SV5.2 | SV5.1 109.22,85.09 107.95,83.82 69.85,83.82 68.58,85.09 SV3.2 | SV3.1 66.04,85.09 64.77,83.82 26.67,83.82 25.4,85.09 SV1.2
  Bottom 1.016: SV1.1 SV1.2 | SV3.1 SV3.2 | SV5.1 SV5.2

### Text on the board
tNames: Ingmarsretro NIXIEUHR / NIXIECLOCK | instagram.com/ingmarsretro | en | clk | str3 | str2 | str1 | data | HV-adjust | Nixiemainboard | reset | designed by / ingmarsretro Nov/2020 | str3 | str2 | str1 | en | clk | data | rev.0 | gnd | res | mosi | sck | +5V | miso | 12VDC
bNames: instagram.com/ingmarsretro | debug-port
Document: hrs | min